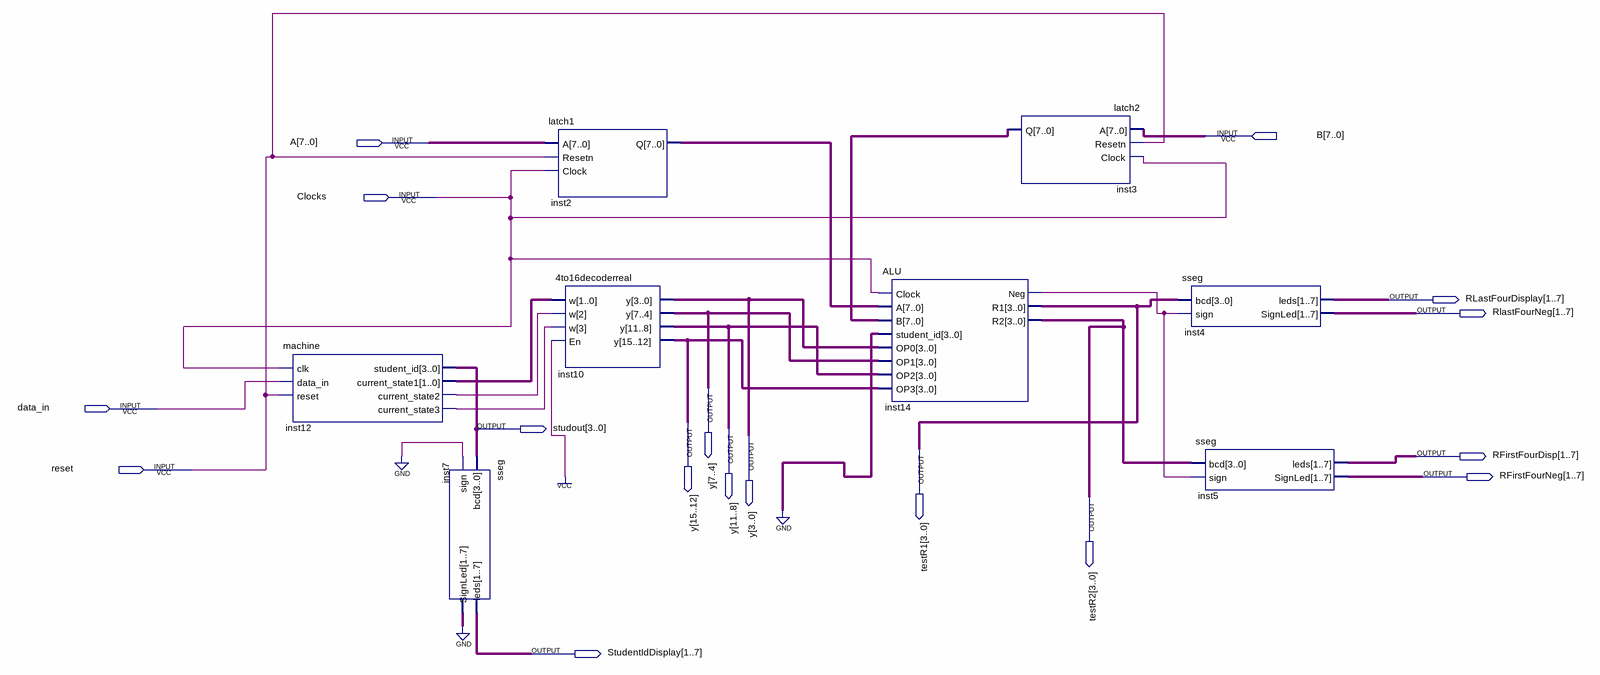
[diagram p0: schematic sheet]
// Quartus schematic FirstALUDiag.bdf as structural Verilog: 8 symbols, 17 pins
module FirstALUDiag (
  input  [7:0] B,
  input  [7:0] A,
  input  Clocks,
  input  data_in,
  input  reset,
  output [1:7] RLastFourDisplay,
  output [1:7] RlastFourNeg,
  output [15:0] y,
  output [3:0] studout,
  output [3:0] testR1,
  output [1:7] RFirstFourDisp,
  output [1:7] RFirstFourNeg,
  output [3:0] testR2,
  output [1:7] StudentIdDisplay
);

  wire inst12_current_state2, inst12_current_state3, inst14_neg;
  wire [1:0] inst12_current_state1;
  wire [6:0] inst7_signled;
  wire [7:0] inst2_q, inst3_q;

  machine inst12 (
    .clk(Clocks), .data_in(data_in), .reset(reset), .student_id(studout),
    .current_state1(inst12_current_state1), .current_state2(inst12_current_state2),
    .current_state3(inst12_current_state3));
  sseg inst7 (.bcd(studout), .sign(1'b0), .leds(StudentIdDisplay), .SignLed(inst7_signled));
  latch1 inst2 (.A(A), .Resetn(reset), .Clock(Clocks), .Q(inst2_q));
  \4to16decoderreal  inst10 (
    .w({inst12_current_state3, inst12_current_state2, inst12_current_state1}), .En(1'b1), .y(y));
  ALU inst14 (
    .Clock(Clocks), .A(inst2_q), .B(inst3_q), .student_id(4'b0000), .OP0(y[3:0]), .OP1(y[7:4]),
    .OP2(y[11:8]), .OP3(y[15:12]), .Neg(inst14_neg), .R1(testR1), .R2(testR2));
  latch2 inst3 (.A(B), .Resetn(reset), .Clock(Clocks), .Q(inst3_q));
  sseg inst4 (.bcd(testR1), .sign(inst14_neg), .leds(RLastFourDisplay), .SignLed(RlastFourNeg));
  sseg inst5 (.bcd(testR2), .sign(inst14_neg), .leds(RFirstFourDisp), .SignLed(RFirstFourNeg));
  // also tied to GND on the sheet: {inst7_signled[0], inst7_signled[1], inst7_signled[2], inst7_signled[3], inst7_signled[4], inst7_signled[5], inst7_signled[6]}
endmodule
